# Altium schematic sheet MCU.SchDoc: Dual Wireless Mic TX
size A4; Date: 2011-06-27; DrawnBy: ANOL; Revision: 1.0; SheetNumber: 3; SheetTotal: 3
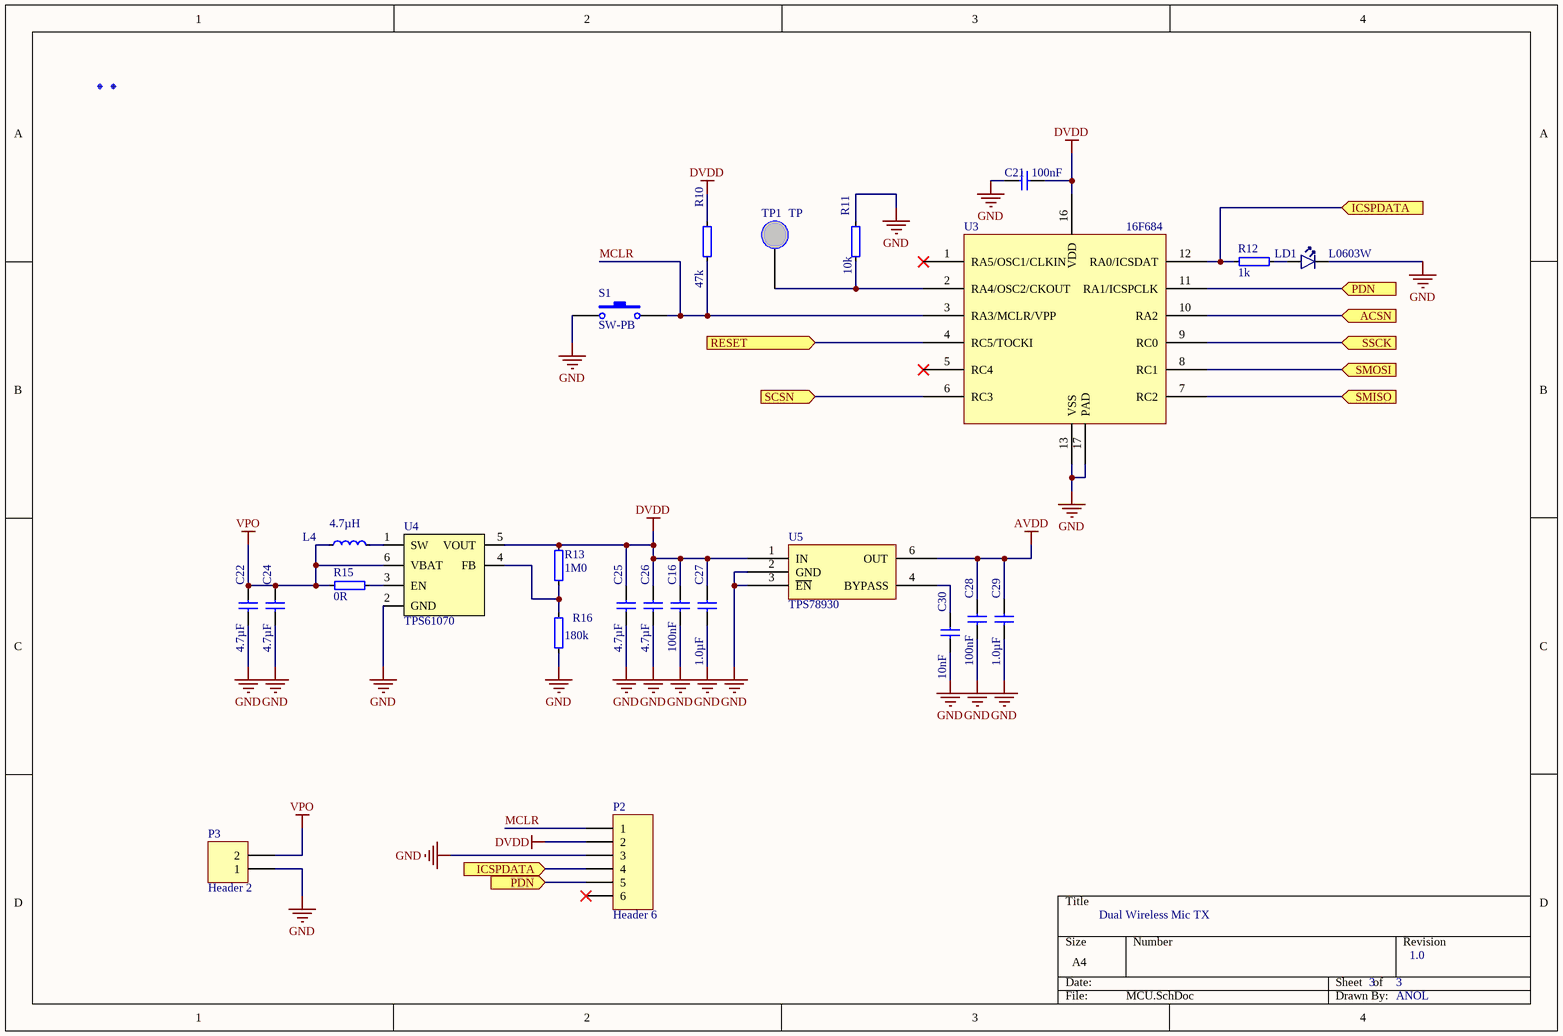
[diagram p0: MCU.SchDoc]

## Parts
C16  100nF  [0402s]
C21  100nF  [0402s]
C22  4.7µF  [0603s]
C24  4.7µF  [0603s]
C25  4.7µF  [0603s]
C26  4.7µF  [0603s]
C27  1.0µF  [0603s]
C28  100nF  [0402s]
C29  1.0µF  [0603s]
C30  10nF  [0402s]
Fid1  Fiducial mark  [Fiducial]  (value not drawn)
Fid2  Fiducial mark  [Fiducial]  (value not drawn)
L4  4.7µH  [WE-TPC_TYPE_S]
LD1  L0603W  [LED_0603]
P2  Header 6  [HDR1X6]
P3  Header 2  [HDR1X2]
R10  47k  [0402s]
R11  10k  [0402s]
R12  1k  [0402s]
R13  1M0  [0402s]
R15  0R  [0402s]
R16  180k  [0402s]
S1  SW-PB  [E-Switch]
TP1  TP  [TP]
U3  16F684  [QFN65P400X400X100-16N]
U4  TPS61070  [SOT95P280X110-6N]
U5  TPS78930  [SOT95P280X145-6N]

## Ports
ACSN (in), ICSPDATA (in), PDN (in), RESET (in), SCSN (in), SMISO (in), SMOSI (in), SSCK (in)

## Nets
AVDD: C28.2 C29.2 U5.6(OUT)
DVDD: C16.2 C21.2 C25.2 C26.2 C27.2 P2.2 R10.2 R13.2 U3.16(VDD) U4.5(VOUT) U5.1(IN)
GND: C16.1 C21.1 C22.1 C24.1 C25.1 C26.1 C27.1 C28.1 C29.1 C30.1 LD1.1(C) P2.3 P3.1 R11.2 R16.1 S1.1 U3.13(VSS) U3.17(PAD) U4.2(GND) U5.2(GND) U5.3(~{EN})
VPO: C22.2 C24.2 L4.1 P3.2 R15.1 U4.6(VBAT)
ACSN: U3.10(RA2) ; port ACSN
ICSPDATA: P2.4 R12.1 U3.12(RA0/ICSDAT) ; port ICSPDATA
MCLR: P2.1 R10.1 S1.2 U3.3(RA3/MCLR/VPP)
PDN: P2.5 U3.11(RA1/ICSPCLK) ; port PDN
RESET: U3.4(RC5/TOCKI) ; port RESET
SCSN: U3.6(RC3) ; port SCSN
SMISO: U3.7(RC2) ; port SMISO
SMOSI: U3.8(RC1) ; port SMOSI
SSCK: U3.9(RC0) ; port SSCK
NetC30_2: C30.2 U5.4(BYPASS)
NetL4_2: L4.2 U4.1(SW)
NetLD1_2: LD1.2(A) R12.2
NetR11_1: R11.1 TP1.1 U3.2(RA4/OSC2/CKOUT)
NetR13_1: R13.1 R16.2 U4.4(FB)
NetR15_2: R15.2 U4.3(EN)

Not connected (* = marked no-connect by the designer): P2 6*; U3 1(RA5/OSC1/CLKIN)* 5(RC4)* 14(NC) 15(NC)

## Library data of the parts
C16 C21 C28 = C0402-100n: Chip Cap 0402; Note: Chip Cap 10%; Artikkelnr Noca: 20039200; Part Number: C0402-100n; Manufacturer: *; Manufacturer Part Number: *; Datasheet: *; LatestRevisionDate: 2009-11-23; Pin Count: 2; Publisher: Nordic Semiconductor; Published: 2009-05-08; Value: 100nF; Supplier: *; Supplier part number: *; 2nd source Supplier: *; 2nd source part number: *
C22 C24-C26 = C0603-4µ7: Chip Cap 0603; Note: Chip Cap 10%; Artikkelnr Noca: 20069060; Part Number: C0603-4µ7; Manufacturer: *; Manufacturer Part Number: *; Datasheet: *; LatestRevisionDate: 2009-11-23; Pin Count: 2; Publisher: Nordic Semiconductor; Published: 2009-05-08; Value: 4.7µF; Supplier: *; Supplier part number: *; 2nd source Supplier: *; 2nd source part number: *
C27 C29 = C0603-1µ0: Chip Cap 0603; Note: Chip Cap 10%; Artikkelnr Noca: 20039205; Part Number: C0603-1µ0; Manufacturer: *; Manufacturer Part Number: *; Datasheet: *; LatestRevisionDate: 2009-11-23; Pin Count: 2; Publisher: Nordic Semiconductor; Published: 2009-05-08; Value: 1.0µF; Supplier: *; Supplier part number: *; 2nd source Supplier: *; 2nd source part number: *
C30 = C0402-10n: Chip Cap 0402; Note: Chip Cap 10%; Artikkelnr Noca: 20039166; Part Number: C0402-10n; Manufacturer: *; Manufacturer Part Number: *; Datasheet: *; LatestRevisionDate: 2009-11-23; Pin Count: 2; Publisher: Nordic Semiconductor; Published: 2009-05-08; Value: 10nF; Supplier: *; Supplier part number: *; 2nd source Supplier: *; 2nd source part number: *
Fid1 Fid2 = Fid-Mark: Artikkelnr Noca: N.A.; Part Number: Fid-Mark; Manufacturer: *; Manufacturer Part Number: *; Datasheet: *; LatestRevisionDate: 12.12.2009; Pin Count: 1; Publisher: Nordic Semiconductor; Published: 12.12.2009; Value: *; Note: *; Supplier: *; Supplier part number: *; 2nd source Supplier: *; 2nd source part number: *
L4 = WE-TPC Type S - 4µ7: Inductor Power 4.7uH 1.2A SMD; Manufacturer: Wurth Elektronik; Manufacturer Part Number: 744031004; 2nd source part number: 732-1008-1-ND; Part Number: WE-TPC Type S - 4µ7; Datasheet: http://www.we-online.de/katalog/media/pdf/744031004.pdf; LatestRevisionDate: 2010-02-01; Pin Count: 2; Publisher: Nordic Semiconductor; Published: 2010-02-01; Value: 4.7µH; Note: *; Supplier: Farnell; Supplier part number: 163-5834; 2nd source Supplier: Digi-Key; Artikkelnr Noca: *
LD1 = 19-213/W1D: LED 0603, 19-213/W1D; Manufacturer: Everlight; Note: 45 mcd; Artikkelnr Noca: N.A.; Part Number: 19-213/W1D; Manufacturer Part Number: *; Datasheet: *; Footprint: 0603; LatestRevisionDate: 2009-05-18; Pin Count: 2; Publisher: Nordic Semiconductor; Published: 2009-05-18; Value: L0603W; Supplier: *; Supplier part number: *; 2nd source Supplier: *; 2nd source part number: *
P2 = Header 6: Header, 6-Pin; LatestRevisionDate: 17-Jul-2002; LatestRevisionNote: Re-released for DXP Platform.; Publisher: Altium Limited
P3 = Header 2: Header, 2-Pin; LatestRevisionDate: 17-Jul-2002; LatestRevisionNote: Re-released for DXP Platform.; Publisher: Altium Limited
R10 = R0402-47k: Chip Res 0402; Note: Chip Res 1%; Artikkelnr Noca: 27049113; Part Number: R0402-47k; Manufacturer: *; Manufacturer Part Number: *; Datasheet: *; Footprint: 0402; LatestRevisionDate: 2009-11-23; Pin Count: 2; Publisher: Nordic Semiconductor; Published: 2009-05-08; Value: 47k; Supplier: *; Supplier part number: *; 2nd source Supplier: *; 2nd source part number: *
R11 = R0402-10k: Chip Res 0402; Note: Chip Res 1%; Artikkelnr Noca: 27049097; Part Number: R0402-10k; Manufacturer: *; Manufacturer Part Number: *; Datasheet: *; Footprint: 0402; LatestRevisionDate: 2009-11-23; Pin Count: 2; Publisher: Nordic Semiconductor; Published: 2009-05-08; Value: 10k; Supplier: *; Supplier part number: *; 2nd source Supplier: *; 2nd source part number: *
R12 = R0402-1k0: Chip Res 0402; Note: Chip Res 1%; Artikkelnr Noca: 27049073; Part Number: R0402-1k0; Manufacturer: *; Manufacturer Part Number: *; Datasheet: *; Footprint: 0402; LatestRevisionDate: 2009-11-23; Pin Count: 2; Publisher: Nordic Semiconductor; Published: 2009-05-08; Value: 1k; Supplier: *; Supplier part number: *; 2nd source Supplier: *; 2nd source part number: *
R13 = R0402-1M0: Chip Res 0402; Note: Chip Res 1%; Artikkelnr Noca: 27049145; Part Number: R0402-1M0; Manufacturer: *; Manufacturer Part Number: *; Datasheet: *; Footprint: 0402; LatestRevisionDate: 2009-11-23; Pin Count: 2; Publisher: Nordic Semiconductor; Published: 2009-05-08; Value: 1M0; Supplier: *; Supplier part number: *; 2nd source Supplier: *; 2nd source part number: *
R15 = R0402-0R: Chip Res 0402; Note: Chip Res 1%; Artikkelnr Noca: 27049000; Part Number: R0402-0R; Manufacturer: *; Manufacturer Part Number: *; Datasheet: *; Footprint: 0402; LatestRevisionDate: 2009-11-23; Pin Count: 2; Publisher: Nordic Semiconductor; Published: 2009-05-08; Value: 0R; Supplier: *; Supplier part number: *; 2nd source Supplier: *; 2nd source part number: *
R16 = R0402-180k: Chip Res 0402; Note: Chip Res 1%; Artikkelnr Noca: 27049127; Part Number: R0402-180k; Manufacturer: *; Manufacturer Part Number: *; Datasheet: *; Footprint: 0402; LatestRevisionDate: 2009-11-23; Pin Count: 2; Publisher: Nordic Semiconductor; Published: 2009-05-08; Value: 180k; Supplier: *; Supplier part number: *; 2nd source Supplier: *; 2nd source part number: *
S1 = SW-PB: Switch; Published: 24-Mar-1999; LatestRevisionDate: 17-Jul-2002; LatestRevisionNote: Re-released for DXP Platform.; PackageReference: SPST-2; Publisher: Altium Limited; PackageDescription: Switch; 2 Leads
U4 = TPS61070: IC BOOST CONV 600MA SW TSOT23-6; Manufacturer: Texas Instruments; Manufacturer Part Number: TPS61070DDCR; 2nd source part number: 296-17151-1-ND; Note: Adjustable, 600-mA Switch, 90% Efficient PFM/PWM Boost Converter in ThinSOT-23; Artikkelnr Noca: N.A.; Part Number: TPS61070; Datasheet: http://focus.ti.com/lit/ds/symlink/tps61070.pdf; Footprint: SOT-23-6; LatestRevisionDate: 2010-02-02; Pin Count: 6; Publisher: Nordic Semiconductor; Published: 2010-02-02; Value: TPS61070; Supplier: Farnell; Supplier part number: 1461062; 2nd source Supplier: Digi-Key